# EAGLE design Cansat2019_1516_Container_v06 (EAGLE 7.3.0)
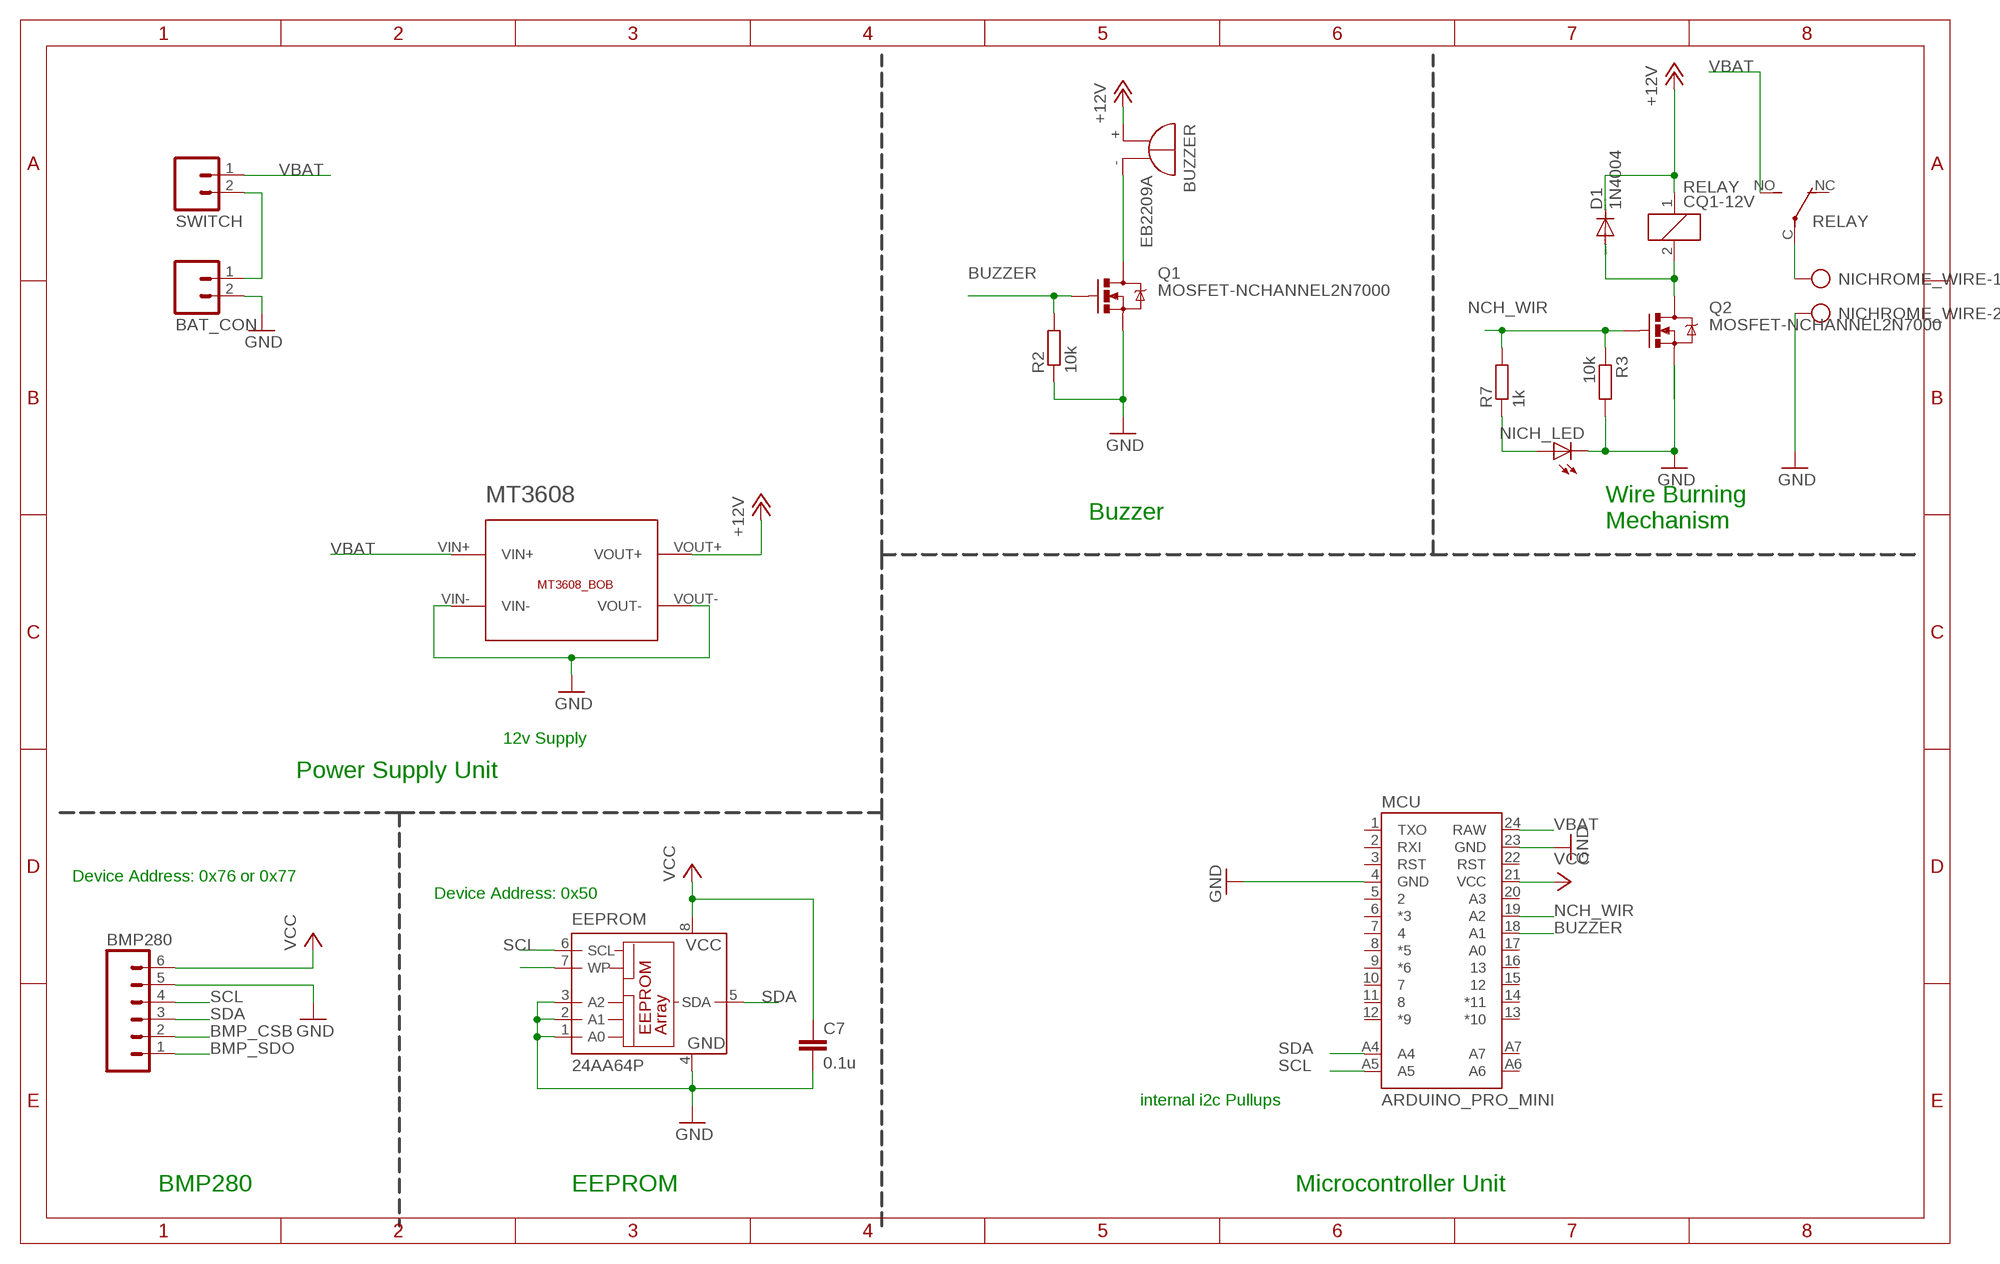
[diagram p0: schematic, sheet 1]

## Parts
BAT_CON  M02  [02P]
BMP280  M06  [06P]
BUZZER  EB2209A  [EB2209A]
C7  0.1u  C-EU025-025X050  [C025-025X050]
D1  1N4004  [DO41-10]
EEPROM  24AA64P  [DIL8]
MCU  ARDUINO_PRO_MINI  [ARDUINO_PRO_MINI]
MT3608  MT3608_BOB  [MT3608_BOB]
NICH_LED  LED3MM  [LED3MM]
NICHROME_WIRE  AK500/2-H  [AK500/2-H]
Q1  MOSFET-NCHANNEL2N7000  [TO-92]
Q2  MOSFET-NCHANNEL2N7000  [TO-92]
R2  10k  R-EU_0204/7  [0204/7]
R3  10k  R-EU_0204/7  [0204/7]
R7  1k  R-EU_0204/7  [0204/7]
RELAY  CQ1-12V  [CQ1]
SWITCH  M02  [02P]

## Nets
+12V [power]: BUZZER.+ D1.C MT3608.VOUT+ RELAY.1
BMP_CSB: BMP280.2
BMP_SDO: BMP280.1
BUZZER: MCU.18(A1) Q1.2(G) R2.2
GND [burner]: BAT_CON.2 BMP280.5 C7.2 EEPROM.1(A0) EEPROM.2(A1) EEPROM.3(A2) EEPROM.4(GND) MCU.4(GND) MCU.23(GND) MT3608.VIN- MT3608.VOUT- NICH_LED.K(C) NICHROME_WIRE.2 Q1.1(S) Q2.1(S) R2.1 R3.2
N$1 [power]: BUZZER.- Q1.3(D)
N$2 [burner]: NICHROME_WIRE.1 RELAY.C(2:P)
N$4: NICH_LED.A R7.1
N$6 [burner]: BAT_CON.1 SWITCH.2
N$7 [power]: D1.A Q2.3(D) RELAY.2
N$8: EEPROM.7(WP)
NCH_WIR: MCU.19(A2) Q2.2(G) R3.1 R7.2
SCL: BMP280.4 EEPROM.6(SCL) MCU.A5
SDA: BMP280.3 EEPROM.5(SDA) MCU.A4
VBAT [power]: MCU.24(RAW) MT3608.VIN+ RELAY.NO(2:S) SWITCH.1
VCC [power]: BMP280.6 C7.1 EEPROM.8(VCC) MCU.21(VCC)
Unconnected: MCU.1(TXO) MCU.2(RXI) MCU.3(RST) MCU.5 MCU.6(*3) MCU.7 MCU.8(*5) MCU.9(*6) MCU.10 MCU.11 MCU.12(*9) MCU.13(*10) MCU.14(*11) MCU.15 MCU.16 MCU.17(A0) MCU.20(A3) MCU.22(RST) MCU.A6 MCU.A7 RELAY.NC(2:O)

## Notes on the sheet
- Buzzer
- Wire Burning
  Mechanism
- 12v Supply
- Power Supply Unit
- Device Address: 0x76 or 0x77
- Device Address: 0x50
- internal i2c Pullups
- BMP280 | EEPROM | Microcontroller Unit

## Library data of the parts
BAT_CON SWITCH = CEDT_JANUARY_2015_v5:M02: AMP QUICK CONNECTOR
BMP280 = con-amp-quick:M06: AMP QUICK CONNECTOR; OC_FARNELL: unknown; OC_NEWARK: unknown
BUZZER = buzzer:EB2209A: BUZZER Source: Buerklin; OC_FARNELL: unknown; OC_NEWARK: unknown
C7 = rcl:C-EU: CAPACITOR, European symbol
D1 = diode:1N4004: DIODE general purpose rectifier, 1 A
EEPROM = microchip:24*: Serial EEPROM I2C; MF: MICROCHIP; MPN: 24AA64-I/P; OC_FARNELL: 1331303; OC_NEWARK: 92C6909
MCU = SparkFun-Boards - Copy:ARDUINO_PRO_MINI
MT3608 = Breakouts:MT3608_BOB
NICH_LED = 01_adafruit:LED: LED OSRAM: - CHIPLED LG R971, LG N971, LY N971, LG Q971, LY Q971, LO R971, LY R971 LH N974, LH R974 LS Q976, LO Q976, LY Q976 LO Q996 - Hyper CHIPLED LW Q18S LB Q993, LB Q99A, LB R99A - SideLED LS A670, LO A670, LY A670, LG A670, LP A670 LB A673, LV A673, LT A673, LW A673 LH A674 LY A675 LS A676, LA A676, LO A676, LY A676, LW A676 LS A679, LY A679, LG A679 - Hyper Micro SIDELED® LS Y876, LA Y876, LO Y876, LY Y876 LT Y87S - SmartLED LW L88C, LW L88S LB L89C, LB L89S, LG L890 LS L89K, LO L89K, LY L89K LS L896, LA L896, LO L896, LY L896 - TOPLED LS T670, LO T670, LY T670, LG T670, LP T670 LSG T670, LSP T670, LSY T670, LOP T670, LYG T670 LG T671, LOG T671, LSG T671 LB T673, LV T673, LT T673, LW T673 LH T674 LS T676, LA T676, LO T676, LY T676, LB T676, LH T676, LSB T676, LW T676 LB T67C, LV T67C, LT T67C, LS T67K, LO T67K, LY T67K, LW E67C LS E67B, LA E67B, LO E67B, LY E67B, LB E67C, LV E67C, LT E67C LW T67C LS T679, LY T679, LG T679 LS T770, LO T770, LY T770, LG T770, LP T770 LB T773, LV T773, LT T773, LW T773 LH T774 LS E675, LA E675, LY E675, LS T675 LS T776, LA T776, LO T776, LY T776, LB T776 LHGB T686 LT T68C, LB T68C - Hyper Mini TOPLED® LB M676 - Mini TOPLED Santana® LG M470 LS M47K, LO M47K, LY M47K Source: http://www.osram.convergy.de/
NICHROME_WIRE = con-ptr500:AK500/2-H: CONNECTOR Aug. 2004 / PTR Meßtechnik: Die Bezeichnung der Serie AK505 wurde geändert. Es handelt sich hierbei um AK500 in horizontaler Ausführung.; OC_FARNELL: unknown; OC_NEWARK: unknown
Q1 Q2 = SparkFun-DiscreteSemi:MOSFET-NCHANNEL: Common NMOSFET Parts MFG P/N Store ID Prod ID FDD8780 TRANS-09984 SI7820DN TRANS-11055 FDS6630A IC-08089 2N7002PW TRANS-11151 FQP30N06L COM-10213 TRANS-10060 BSS123LT1G TRANS-08345 BSS138 TRANS-00830 BS170 2N7000
R2 R3 R7 = rcl:R-EU_: RESISTOR, European symbol
RELAY = relay:CQ1-12V: AUTOMOTIVE QUIET RELAY NAiS Source: http://www.mew-europe.com/.. en_ds_61208_0000.pdf; OC_FARNELL: unknown; OC_NEWARK: unknown

## Net classes
0 default: width 0.305 mm
1 power: width 0.61 mm, clearance 0.305 mm
2 burner: width 0.813 mm, clearance 0.305 mm

## Board
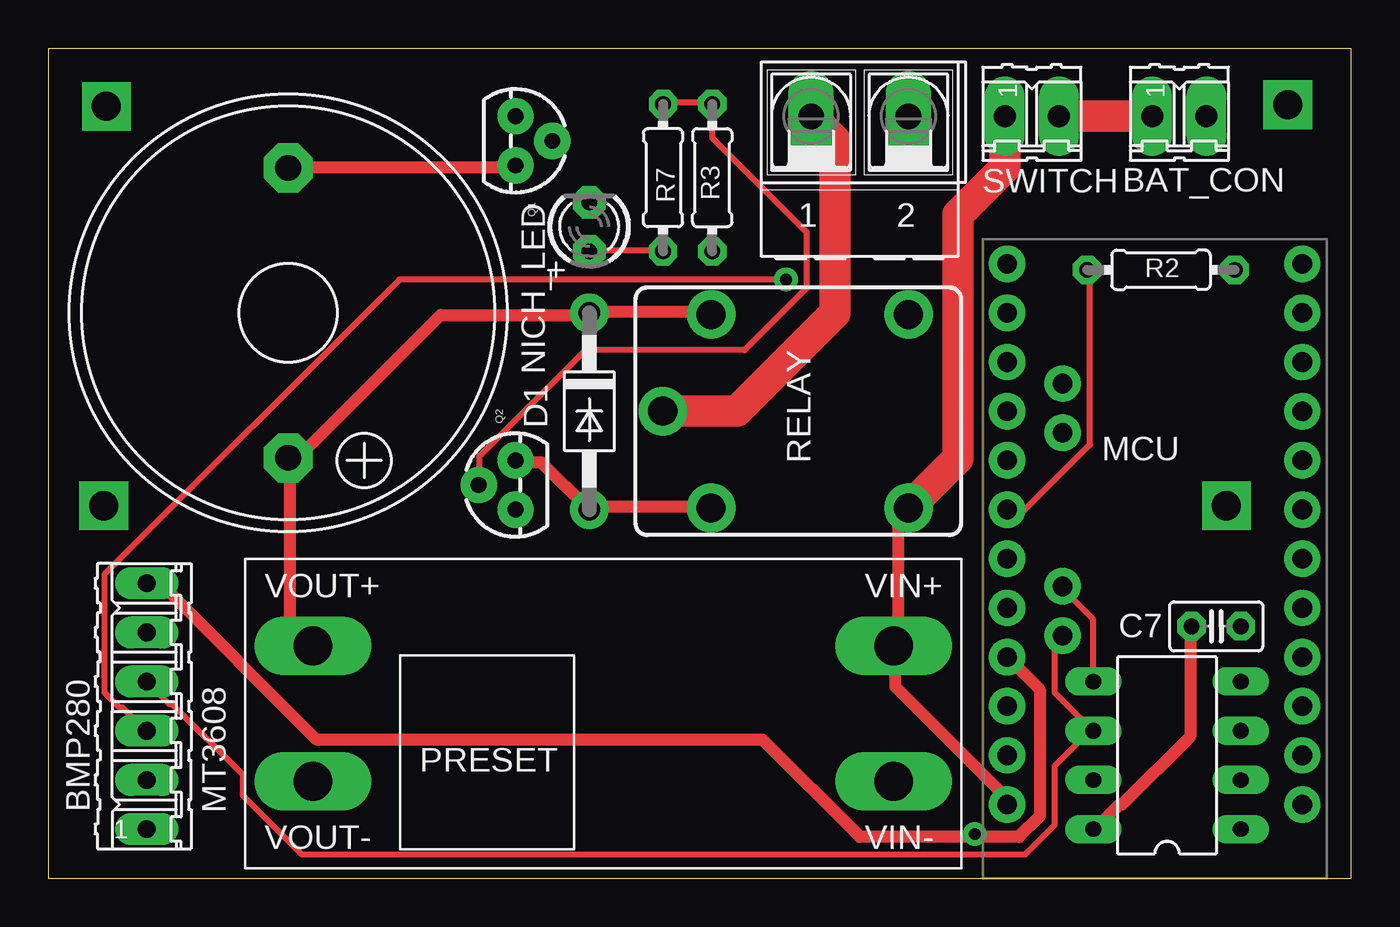
[diagram p1: board, top side]
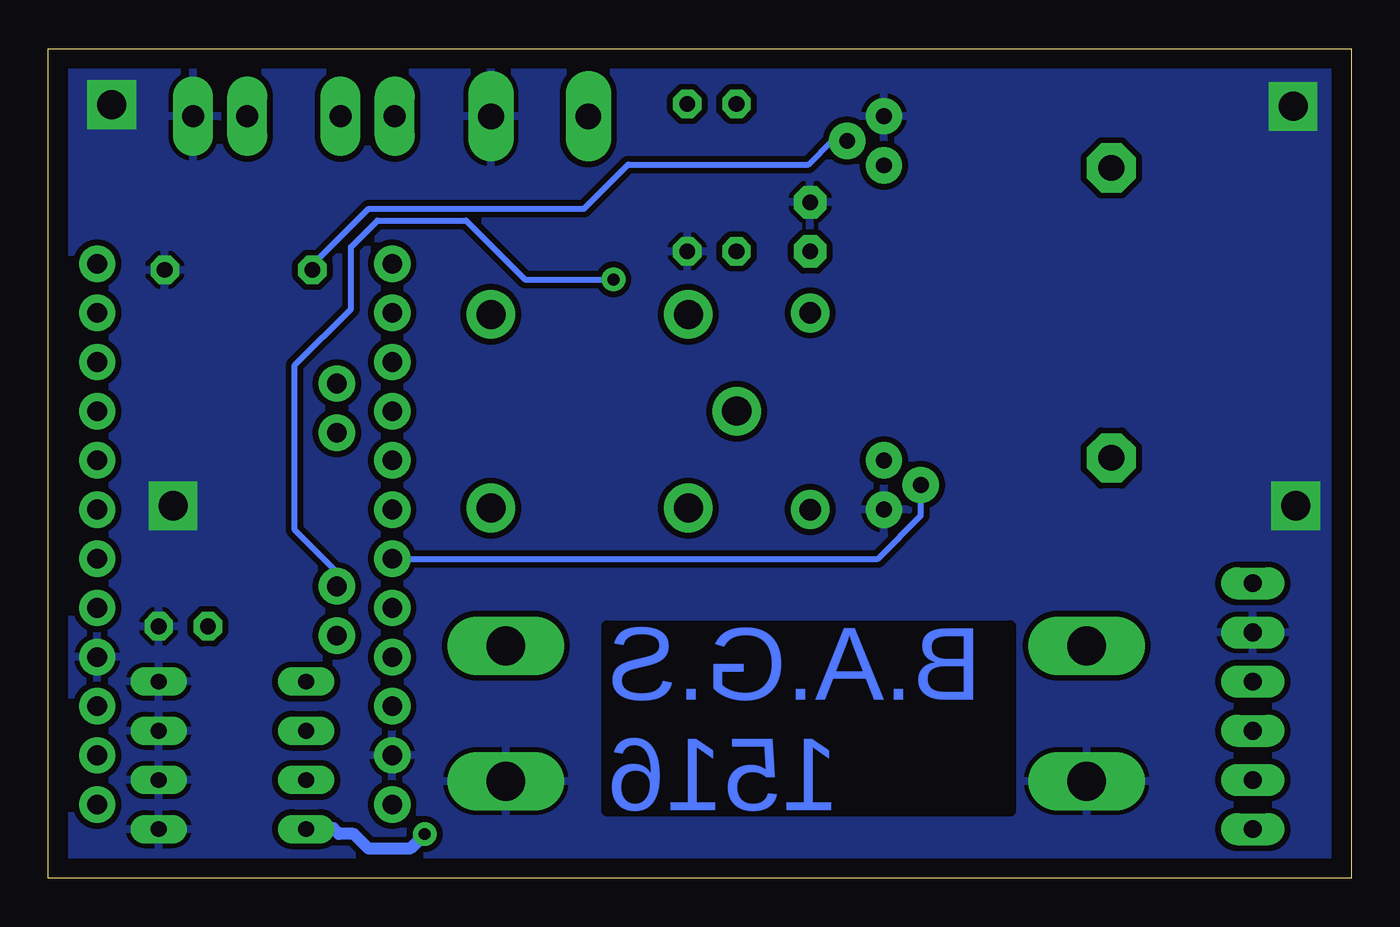
[diagram p2: board, bottom side, seen from below]

Size 67.29 x 42.85 mm. Coordinates in mm from the lower left corner, seen from the top.
Outline: 0,0 67.29,0 67.29,42.85 0,42.85 0,0
Copper layers (1*16): Top 0.035mm / dielectric 1.5mm / Bottom 0.035mm
Design rules "8085_board": minimum track width 10mil, minimum drill 24mil, track to track 8mil, track to pad 8mil, pad to pad 8mil, via to via 8mil, smd to smd 8mil, copper to edge 40mil, drill to drill 8mil, minimum pad ring 12mil, minimum via ring 12mil, stop-mask expansion 4mil, vias tented up to drill 0mil, thermal gap 10mil

### Footprints (pad centres in the part's own frame; a part is rotated, then mirrored left to right if it is on the bottom)
02P = drill 1.143 long: 1 -1.397,0; 2 1.397,0
06P = drill 0.914 long: 1 -6.35,0; 2 -3.81,0; 3 -1.27,0; 4 1.27,0; 5 3.81,0; 6 6.35,0
EB2209A = drill 1.321 pad 2.54 octagon: + 7.493,0; - -7.493,0
C025-025X050 = drill 0.813 octagon: 1 -1.27,0; 2 1.27,0
DO41-10 = drill 1.118: A 5.08,0; C -5.08,0
DIL8 = drill 0.813 long: 1 -3.81,-3.81; 2 -1.27,-3.81; 3 1.27,-3.81; 4 3.81,-3.81; 5 3.81,3.81; 6 1.27,3.81; 7 -1.27,3.81; 8 -3.81,3.81
ARDUINO_PRO_MINI = drill 1.016 pad 1.88: 1 -7.62,12.7; 2 -7.62,10.16; 3 -7.62,7.62; 4 -7.62,5.08; 5 -7.62,2.54; 6 -7.62,0; 7 -7.62,-2.54; 8 -7.62,-5.08; 9 -7.62,-7.62; 10 -7.62,-10.16; 11 -7.62,-12.7; 12 -7.62,-15.24; 13 7.62,-15.24; 14 7.62,-12.7; 15 7.62,-10.16; 16 7.62,-7.62; 17 7.62,-5.08; 18 7.62,-2.54; 19 7.62,0; 20 7.62,2.54; 21 7.62,5.08; 22 7.62,7.62; 23 7.62,10.16; 24 7.62,12.7; A4 4.763,1.429; A5 4.763,3.969; A6 4.763,-9.049; A7 4.763,-6.509
MT3608_BOB = drill 2 pad 3 long: VIN+ 33.5,-4.5; VIN- 33.5,-11.5; VOUT+ 3.5,-4.5; VOUT- 3.5,-11.5
LED3MM = drill 0.813 pad 1.676 octagon: A -1.27,0; K 1.27,0
AK500/2-H = drill 1.321 long: 1 -2.515,0; 2 2.515,0
TO-92 = drill 0.813 pad 1.88: 1 -1.27,0; 2 0,1.905; 3 1.27,0
0204/7 = drill 0.813 octagon: 1 -3.81,0; 2 3.81,0
CQ1 = drill 1.5: 1 4.5,-5; 2 4.5,5; C 7,0; NC -5.7,-5; NO -5.7,5

### Placement (x,y rotation side)
BAT_CON  58.42,39.37 0 top
BMP280  5.08,8.89 90 top
BUZZER  12.38,29.21 270 top
C7  60.33,13.02 0 top
D1  27.94,24.13 270 top
EEPROM  57.78,6.35 90 top
MCU  57.15,16.51 180 top
MT3608  10.16,16.51 0 top
NICH_LED  27.94,33.66 90 top
NICHROME_WIRE  41.91,39.37 0 top
Q1  24.13,38.1 270 top
Q2  24.13,20.32 90 top
R2  57.47,31.43 180 top
R3  34.29,36.2 270 top
R7  31.75,36.2 90 top
RELAY  38.73,24.13 180 top
SWITCH  50.8,39.37 0 top

### Tracks (layer width: path | path; a pad name or v marks a point on that pad's centre or on a via)
+12V
  Top 0.61: RELAY.1 34.14,29.26 28.04,29.26 D1.C 27.74,29.11 20.27,29.11 12.8,21.64 BUZZER.+ 12.5,21.64 12.5,13.11 13.56,12.04 MT3608.VOUT+
BUZZER
  Top 0.305: MCU.18 50.44,19.05 53.8,22.4 53.8,31.39 R2.2
  Bottom 0.305: Q1.2 26.82,38.1 28.04,36.88 37.34,36.88 39.62,34.59 50.75,34.59 53.8,31.55 R2.2
GND  (via drill 1.5)
  other vias: 3,39.88 64.02,39.96 2.85,19.25 60.85,19.25
  pour Bottom: 0,43.18 0,0 67.31,0 67.31,43.18
N$1
  Top 0.61: Q1.3 24.08,36.73 12.5,36.73 BUZZER.-
N$2
  Top 1.626: RELAY.C 35.56,24.13 40.64,29.21 40.64,38.12 NICHROME_WIRE.1
N$4
  Top 0.305: R7.1 31.7,32.46 28.04,32.46 NICH_LED.A
N$6
  Top 1.626: SWITCH.2 BAT_CON.1
N$7
  Top 0.61: Q2.3 24.23,21.49 25.45,21.49 27.89,19.05 D1.A 28.19,19.2 34.14,19.2 RELAY.2
NCH_WIR
  Top 0.305: R7.2 31.85,40.08 34.29,40.08 R3.1 34.29,38.25 39.17,33.38 39.17,30.48 35.97,27.28 27.74,27.28 22.25,21.79 22.25,20.42 Q2.2
  Bottom 0.305: MCU.19 24.45,16.51 22.23,18.73 Q2.2
SCL
  Top 0.305: MCU.A5 52.27,12.5 51.97,12.19 51.97,9.6 53.95,7.62 EEPROM.6 53.8,7.62 51.97,5.79 51.97,2.74 50.44,1.22 13.11,1.22 10.06,4.27 10.06,5.33 6.4,8.99 6.25,8.99 BMP280.4
SDA  (via drill 0.61)
  Top 0.305: EEPROM.5 53.95,10.21 53.95,13.41 52.43,14.94 MCU.A4 | v38.1,30.94 18.14,30.94 2.9,15.7 2.9,9.6 3.66,8.84 3.81,8.84 5.03,7.62 BMP280.3
  Bottom 0.305: v38.1,30.94 42.67,30.94 45.72,33.98 50.29,33.98 51.66,32.61 51.66,29.41 54.56,26.52 54.56,17.98 52.43,15.85 52.43,15.09 MCU.A4
VBAT
  Top 0.61: MCU.24 49.53,4.12 43.74,9.91 43.74,11.89 MT3608.VIN+ 43.89,12.19 43.89,18.44 44.35,18.9 RELAY.NO
  Top 1.626: SWITCH.1 49.4,36.7 46.99,34.29 46.99,21.68 RELAY.NO
VCC  (via drill 0.61)
  Top 0.61: EEPROM.8 54.1,2.59 55.32,3.81 55.47,3.81 58.98,7.32 58.98,12.95 C7.1 | BMP280.6 5.79,15.24 13.87,7.16 36.88,7.16 41.91,2.13 47.85,2.13 | 47.85,2.13 50.14,2.13 51.21,3.2 51.21,9.75 MCU.21 | v47.85,2.29 47.85,2.13
  Bottom 0.61: v47.85,2.29 48.62,1.52 50.75,1.52 51.51,2.29 52.27,2.29 52.58,2.59 53.95,2.59 EEPROM.8

### Text on the board
Bottom: B.A.G.S / 1516